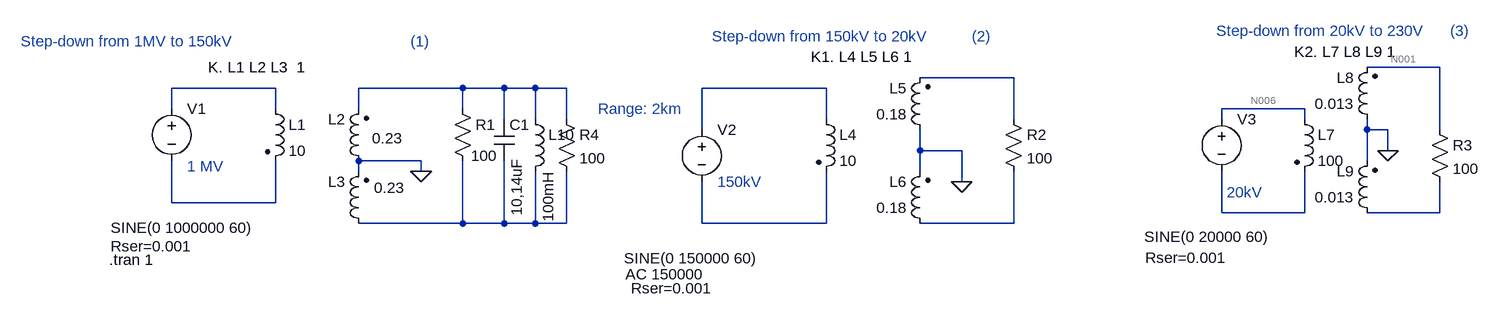
[diagram p0: schematic Stepdown_Simulation.asc]
Stepdown_Simulation.asc, the LTspice schematic file:
Version 4
SHEET 1 1908 680
WIRE 1840 112 1728 112
WIRE 1184 128 1040 128
WIRE 48 144 -112 144
WIRE 336 144 176 144
WIRE 400 144 336 144
WIRE 448 144 400 144
WIRE 496 144 448 144
WIRE 896 144 704 144
WIRE -112 176 -112 144
WIRE 48 176 48 144
WIRE 176 176 176 144
WIRE 336 176 336 144
WIRE 1632 176 1504 176
WIRE 400 192 400 144
WIRE 448 192 448 144
WIRE 496 192 496 144
WIRE 896 192 896 144
WIRE 1184 192 1184 128
WIRE 1504 192 1504 176
WIRE 1632 192 1632 176
WIRE 704 208 704 144
WIRE 1728 208 1728 192
WIRE 1760 208 1728 208
WIRE 1840 208 1840 112
WIRE 1040 240 1040 208
WIRE 1104 240 1040 240
WIRE 1760 240 1760 208
WIRE 272 256 176 256
WIRE 1728 256 1728 208
WIRE 176 272 176 256
WIRE 272 272 272 256
WIRE 1040 272 1040 240
WIRE 1104 288 1104 240
WIRE -112 320 -112 256
WIRE 48 320 48 256
WIRE 48 320 -112 320
WIRE 1504 336 1504 272
WIRE 1632 336 1632 272
WIRE 1632 336 1504 336
WIRE 1840 336 1840 288
WIRE 1840 336 1728 336
WIRE 336 352 336 256
WIRE 336 352 176 352
WIRE 400 352 400 256
WIRE 400 352 336 352
WIRE 448 352 448 272
WIRE 448 352 400 352
WIRE 496 352 496 272
WIRE 496 352 448 352
WIRE 704 352 704 288
WIRE 896 352 896 272
WIRE 896 352 704 352
WIRE 1184 352 1184 272
WIRE 1184 352 1040 352
FLAG 272 272 0
FLAG 1104 288 0
FLAG 1760 240 0
DATAFLAG 256 144 ""
SYMBOL ind2 32 160 R0
SYMATTR InstName L1
SYMATTR Value 10
SYMATTR Type ind
SYMBOL ind2 192 272 R180
WINDOW 0 36 80 Left 2
WINDOW 3 -52 51 Left 2
SYMATTR InstName L2
SYMATTR Value 0.23
SYMATTR Type ind
SYMBOL voltage -112 160 R0
WINDOW 3 -94 199 Left 2
WINDOW 123 0 0 Left 0
WINDOW 39 -94 227 Left 2
SYMATTR Value SINE(0 1000000 60)
SYMATTR SpiceLine Rser=0.001
SYMATTR InstName V1
SYMBOL res 320 160 R0
WINDOW 3 29 88 Left 2
SYMATTR InstName R1
SYMATTR Value 100
SYMBOL ind2 192 368 R180
WINDOW 0 36 80 Left 2
WINDOW 3 -55 71 Left 2
SYMATTR InstName L3
SYMATTR Value 0.23
SYMATTR Type ind
SYMBOL ind2 880 176 R0
SYMATTR InstName L4
SYMATTR Value 10
SYMATTR Type ind
SYMBOL ind2 1056 224 R180
WINDOW 0 36 80 Left 2
WINDOW 3 36 40 Left 2
SYMATTR InstName L5
SYMATTR Value 0.18
SYMATTR Type ind
SYMBOL ind2 1056 368 R180
WINDOW 0 36 80 Left 2
WINDOW 3 36 40 Left 2
SYMATTR InstName L6
SYMATTR Value 0.18
SYMATTR Type ind
SYMBOL res 1168 176 R0
SYMATTR InstName R2
SYMATTR Value 100
SYMBOL voltage 704 192 R0
WINDOW 3 -120 214 Left 2
WINDOW 123 -117 238 Left 2
WINDOW 39 -109 260 Left 2
SYMATTR Value SINE(0 150000 60)
SYMATTR Value2 AC 150000
SYMATTR SpiceLine Rser=0.001
SYMATTR InstName V2
SYMBOL ind2 1616 176 R0
SYMATTR InstName L7
SYMATTR Value 100
SYMATTR Type ind
SYMBOL ind2 1744 208 R180
WINDOW 0 36 80 Left 2
WINDOW 3 36 40 Left 2
SYMATTR InstName L8
SYMATTR Value 0.013
SYMATTR Type ind
SYMBOL ind2 1744 352 R180
WINDOW 0 36 80 Left 2
WINDOW 3 36 40 Left 2
SYMATTR InstName L9
SYMATTR Value 0.013
SYMATTR Type ind
SYMBOL voltage 1504 176 R0
WINDOW 3 -119 197 Left 2
WINDOW 123 0 0 Left 0
WINDOW 39 -117 229 Left 2
SYMATTR Value SINE(0 20000 60)
SYMATTR SpiceLine Rser=0.001
SYMATTR InstName V3
SYMBOL res 1824 192 R0
SYMATTR InstName R3
SYMATTR Value 100
SYMBOL cap 384 192 R0
WINDOW 3 35 59 VRight 2
SYMATTR InstName C1
SYMATTR Value 10,14uF
SYMBOL ind 432 176 R0
WINDOW 3 36 96 VRight 2
SYMATTR InstName L10
SYMATTR Value 100mH
SYMBOL res 480 176 R0
SYMATTR InstName R4
SYMATTR Value 100
TEXT -56 112 Left 2 !K. L1 L2 L3  1
TEXT -208 408 Left 2 !.tran 1
TEXT -344 72 Left 2 ;Step-down from 1MV to 150kV
TEXT 544 176 Left 2 ;Range: 2km
TEXT 872 96 Left 2 !K1. L4 L5 L6 1
TEXT -88 264 Left 2 ;1 MV
TEXT 728 288 Left 2 ;150kV
TEXT 1512 304 Left 2 ;20kV
TEXT 1616 88 Left 2 !K2. L7 L8 L9 1
TEXT 720 64 Left 2 ;Step-down from 150kV to 20kV
TEXT 1496 56 Left 2 ;Step-down from 20kV to 230V
TEXT 256 72 Left 2 ;(1)
TEXT 1120 64 Left 2 ;(2)
TEXT 1856 56 Left 2 ;(3)

The netlist it stands for:
* Stepdown_Simulation.asc
L1 N003 N007 10
L2 0 N004 0.23
V1 N003 N007 SINE(0 1000000 60) Rser=0.001
R1 N004 N010 100
L3 N010 0 0.23
L4 N005 N011 10
L5 0 N002 0.18
L6 N012 0 0.18
R2 N002 N012 100
V2 N005 N011 SINE(0 150000 60) AC 150000 Rser=0.001
L7 N006 N008 100
L8 0 N001 0.013
L9 N009 0 0.013
V3 N006 N008 SINE(0 20000 60) Rser=0.001
R3 N001 N009 100
C1 N004 N010 10,14uF
L10 N004 N010 100mH
R4 N004 N010 100
K. L1 L2 L3  1
.tran 1
* Step-down from 1MV to 150kV
* Range: 2km
K1. L4 L5 L6 1
* 1 MV
* 150kV
* 20kV
K2. L7 L8 L9 1
* Step-down from 150kV to 20kV
* Step-down from 20kV to 230V
* (1)
* (2)
* (3)
.backanno
.end

* Results of the author's LTspice run, read from the files saved beside the schematic
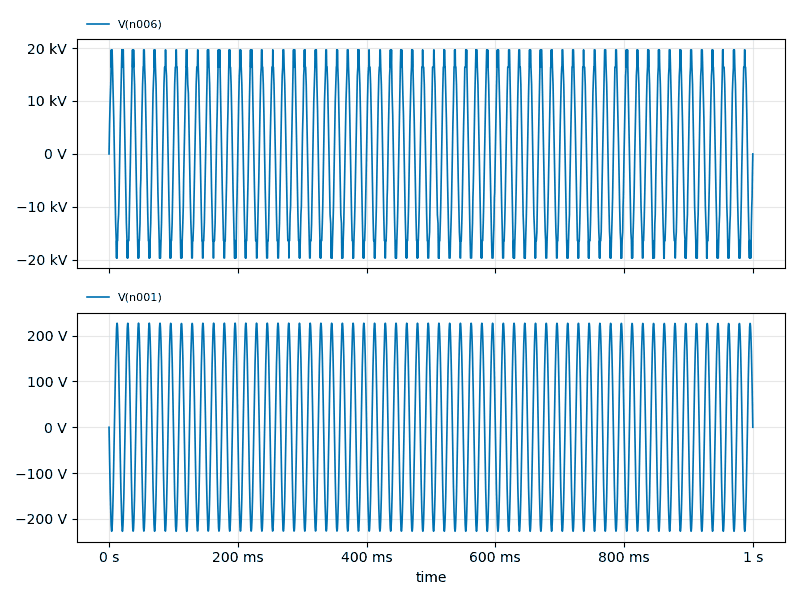
[diagram p1: Transient Analysis of Stepdown_Simulation.asc, plotted from the saved traces]
* Transient Analysis, 1 run:
*   V(n006): min -19.66 kV, max 19.66 kV, average -5.595 V, rms 13.3 kV, last 0 V
*   V(n001): min -227.4 V, max 227.5 V, average 313.8 mV, rms 159.3 V, last 0 V